# EAGLE design PI_Shield (EAGLE 9.1.3)

## Sheet 1 of 3
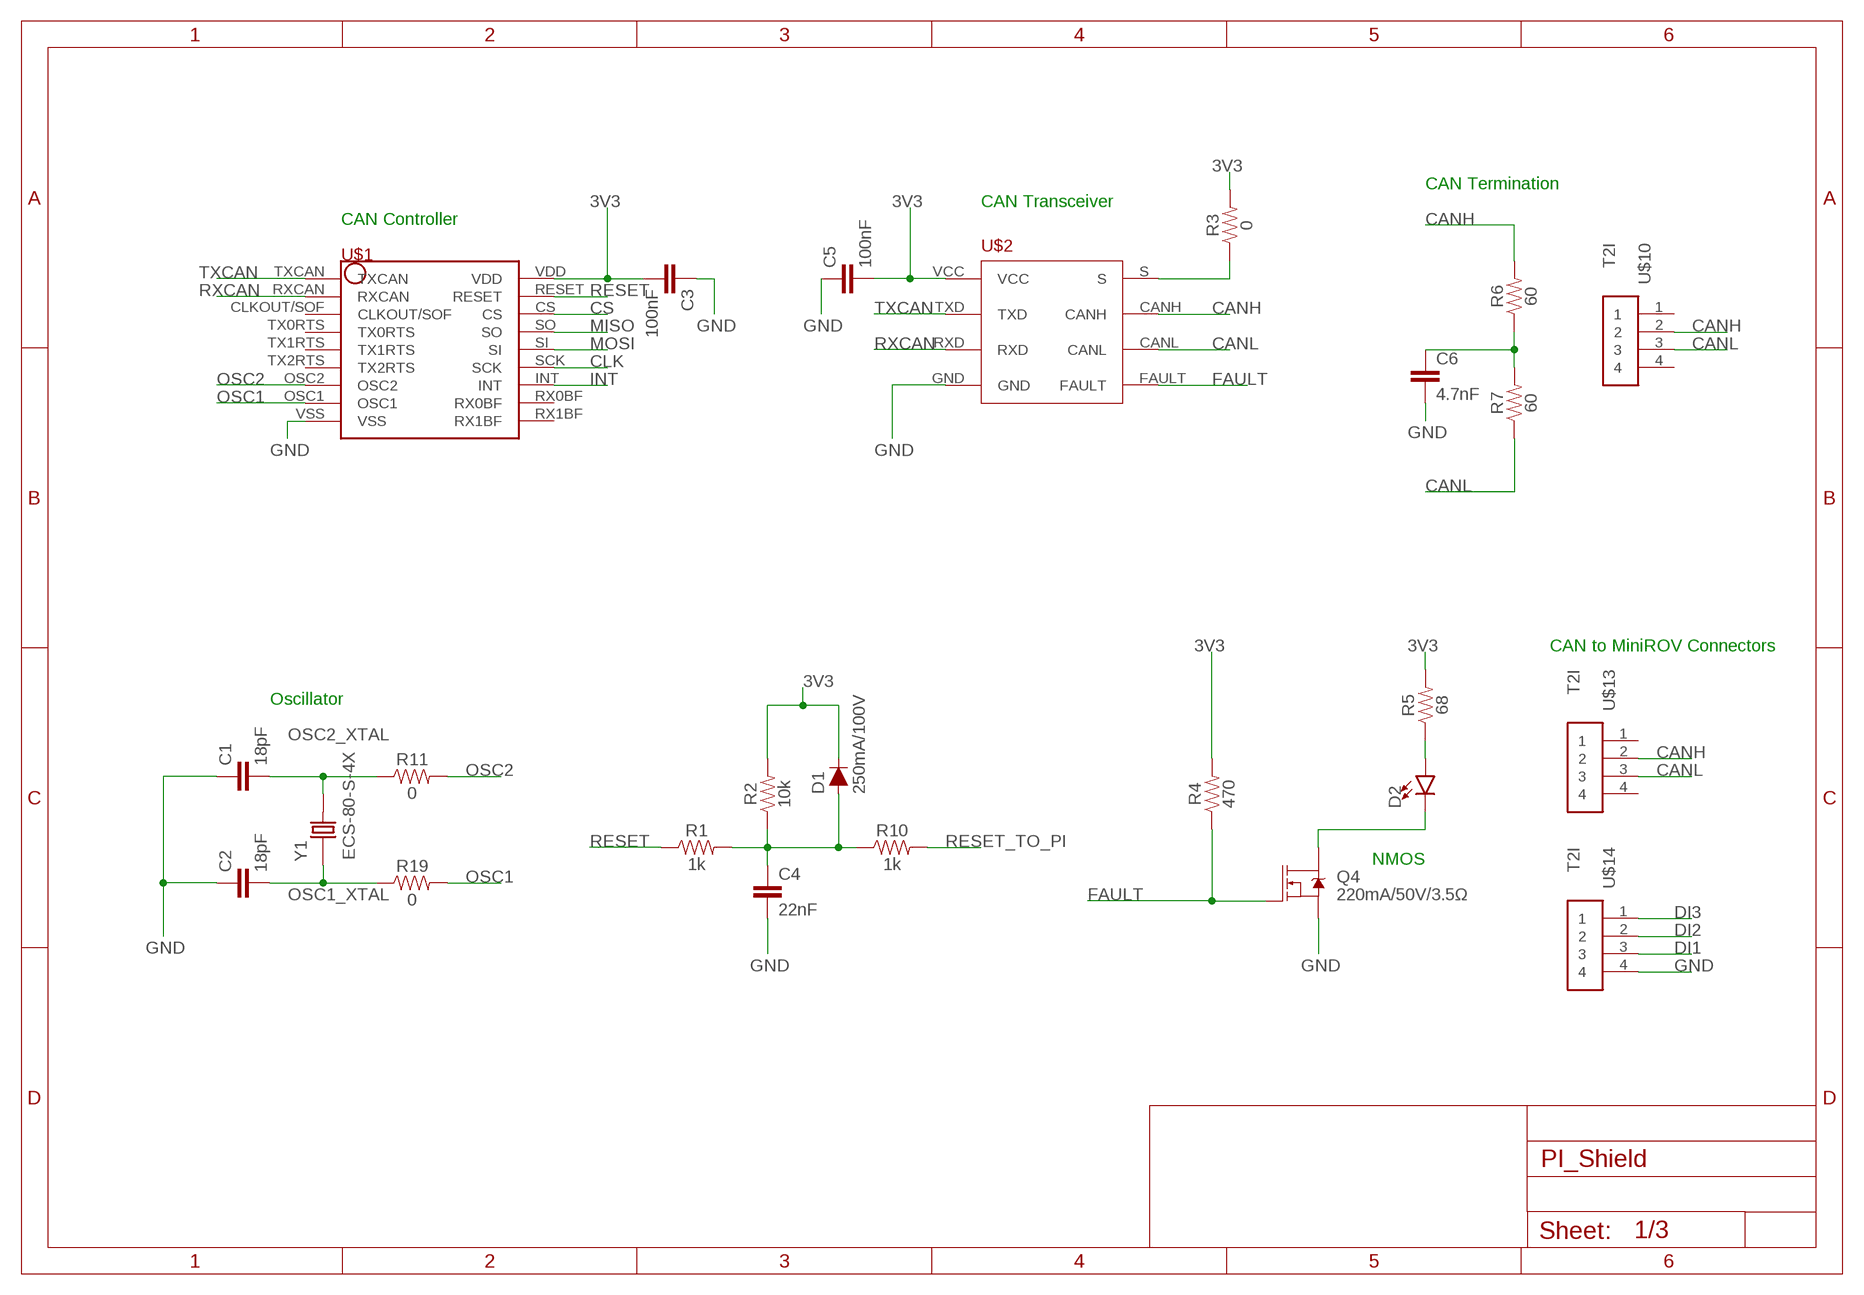
[diagram p0: schematic, sheet 1]

### Parts
C1  18pF  22PF-0603-50V-5%  [0603]
C2  18pF  22PF-0603-50V-5%  [0603]
C3  100nF  22NF/22,000PF-0603-50V-10%  [0603]
C4  22nF  22NF/22,000PF-0603-50V-10%  [0603]
C5  100nF  22NF/22,000PF-0603-50V-10%  [0603]
C6  4.7nF  22NF/22,000PF-0603-50V-10%  [0603]
D1  250mA/100V  DIODE-BAS16J  [SOD-323]
D2  LED0603  [LED-0603]
Q4  220mA/50V/3.5Ω  MOSFET-NCH-BSS138  [SOT23-3]
R1  1k  RESISTOR0603  [0603]
R2  10k  RESISTOR0603  [0603]
R3  0  RESISTOR0603  [0603]
R4  470  RESISTOR0603  [0603]
R5  68  RESISTOR0603  [0603]
R6  60  RESISTOR0603  [0603]
R7  60  RESISTOR0603  [0603]
R10  1k  RESISTOR0603  [0603]
R11  0  RESISTOR0603  [0603]
R19  0  RESISTOR0603  [0603]
U$1  MCP2515  [MCP2515]
U$2  TCAN337D  [TCAN337D]
U$10  T2I  [T2I]
U$13  T2I  [T2I]
U$14  T2I  [T2I]
Y1  ECS-80-S-4X  [XTAL_ECS-80-S-4X]

### Nets
3V3: C3.2 C5.2 D1.C R2.2 R3.2 R4.2 R5.2 U$1.VDD U$2.VCC ; also sheet 2,3
CANH: R6.2 U$2.CANH U$10.2 U$13.2 ; also sheet 2
CANL: R7.1 U$2.CANL U$10.3 U$13.3 ; also sheet 2
CLK: U$1.SCK ; also sheet 2
CS: U$1.CS ; also sheet 2
DI1: U$14.3 ; also sheet 2
DI2: U$14.2 ; also sheet 2
DI3: U$14.1 ; also sheet 2
FAULT: Q4.1(G) R4.1 U$2.FAULT
GND: C1.1 C2.1 C3.1 C4.2 C5.1 C6.2 Q4.2(S) U$1.VSS U$2.GND U$14.4 ; also sheet 2,3
INT: U$1.INT ; also sheet 2
MISO: U$1.SO ; also sheet 2
MOSI: U$1.SI ; also sheet 2
N$1: R3.1 U$2.S
N$2: C6.1 R6.1 R7.2
N$3: C4.1 D1.A R1.2 R2.1 R10.1
N$4: D2.C Q4.3(D)
N$5: D2.A R5.1
OSC1: R19.2 U$1.OSC1
OSC1_XTAL: C2.2 R19.1 Y1.1
OSC2: R11.2 U$1.OSC2
OSC2_XTAL: C1.2 R11.1 Y1.2
RESET: R1.1 U$1.RESET
RESET_TO_PI: R10.2 ; also sheet 2
RXCAN: U$1.RXCAN U$2.RXD
TXCAN: U$1.TXCAN U$2.TXD
Unconnected: U$1.CLKOUT/SOF U$1.RX0BF U$1.RX1BF U$1.TX0RTS U$1.TX1RTS U$1.TX2RTS U$10.1 U$10.4 U$13.1 U$13.4

### Notes on the sheet
- CAN Termination
- CAN Transceiver
- CAN Controller
- CAN to MiniROV Connectors
- Oscillator
- NMOS

## Sheet 2 of 3
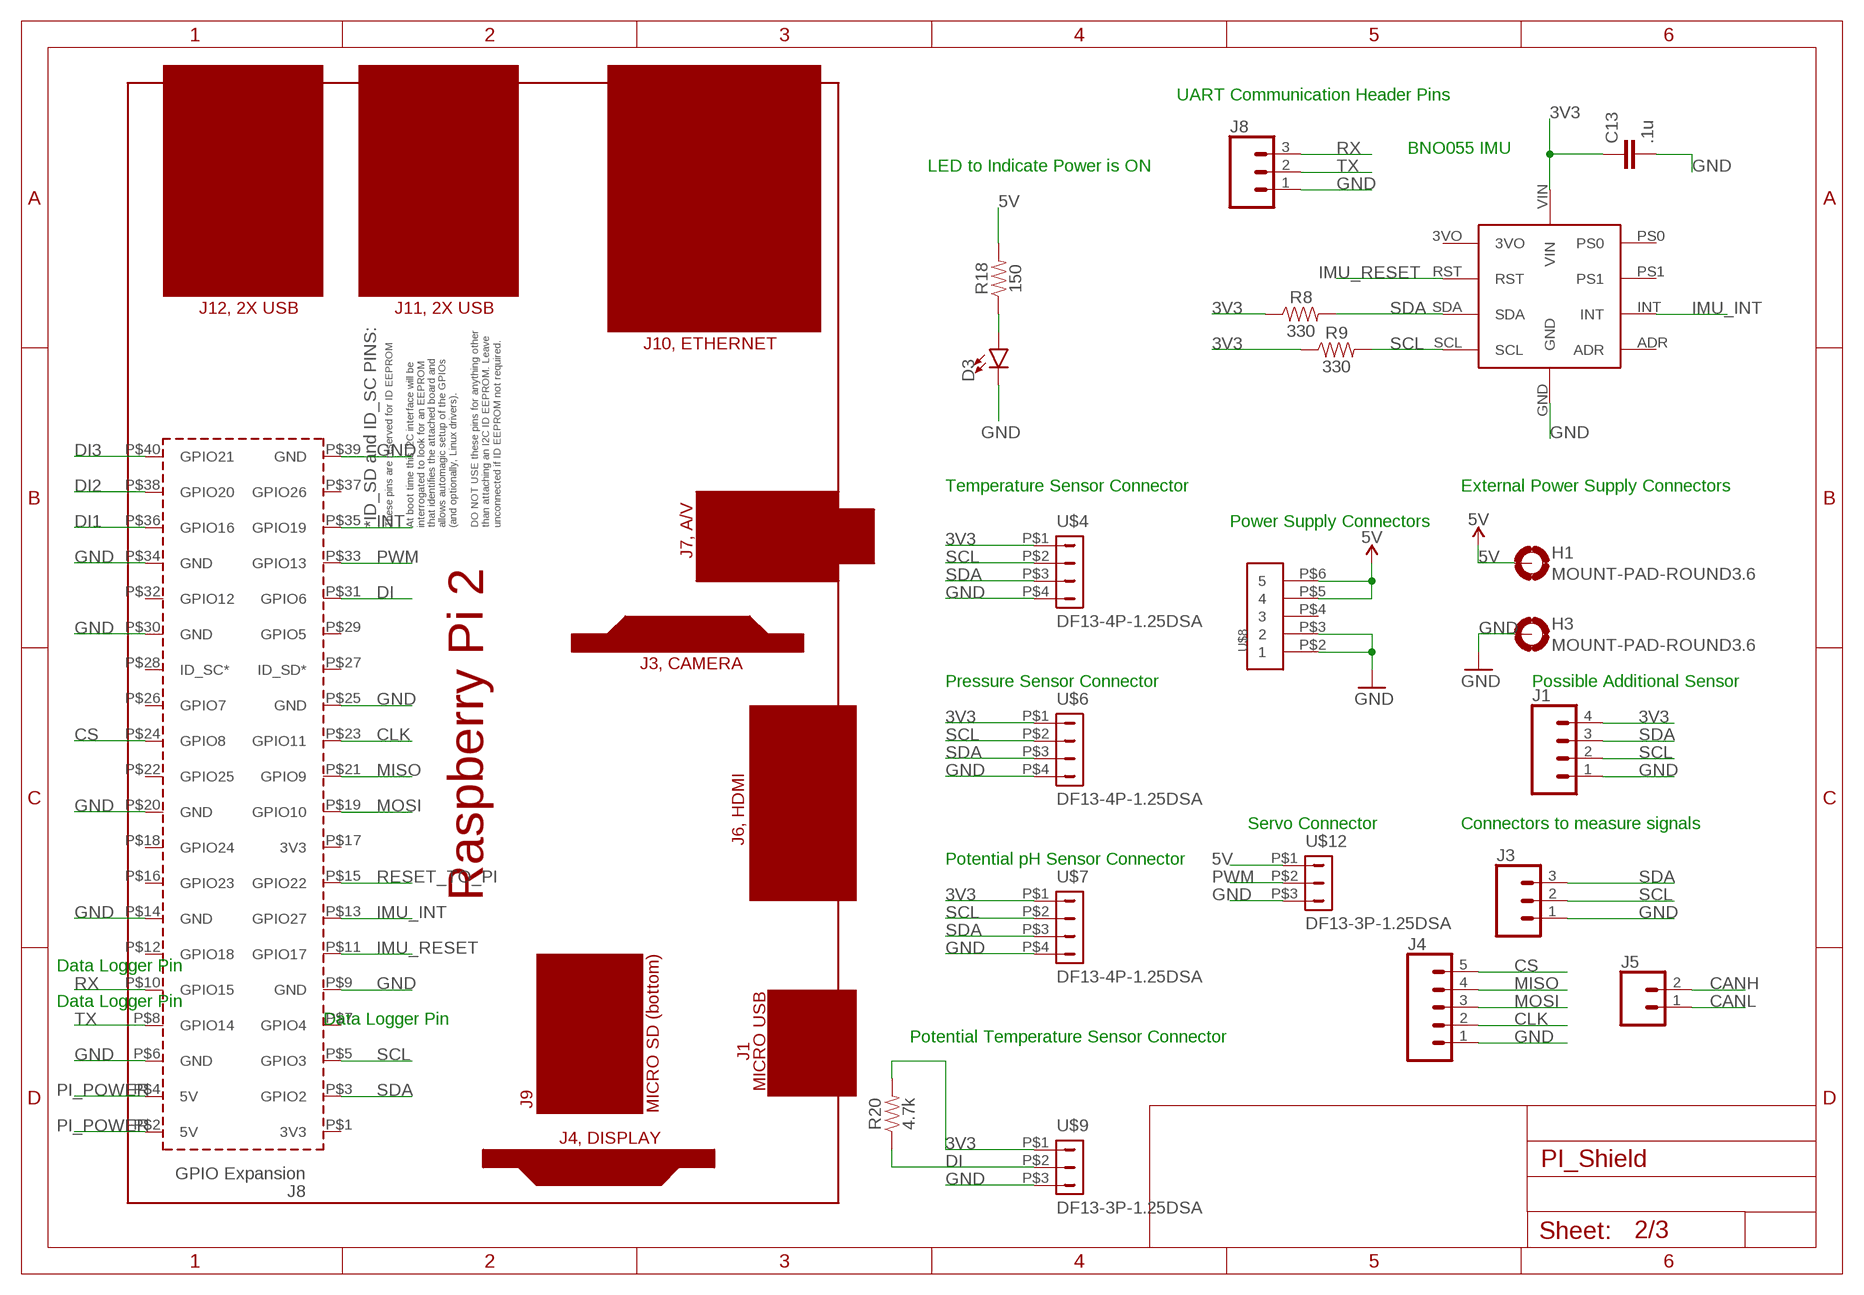
[diagram p1: schematic, sheet 2]

### Parts
C13  .1u  22NF/22,000PF-0603-50V-10%  [0603]
D3  LED0603  [LED-0603]
H1  MOUNT-PAD-ROUND3.6  [3,6-PAD]
H3  MOUNT-PAD-ROUND3.6  [3,6-PAD]
J1  CONN_04  [1X04]
J3  CONN_03  [1X03]
J4  CONN_05  [1X05]
J5  CONN_02  [1X02]
J8  CONN_03  [1X03]
PCB1  RPI2  [RPI2]
R8  330  RESISTOR0603  [0603]
R9  330  RESISTOR0603  [0603]
R18  150  RESISTOR0603  [0603]
R20  4.7k  RESISTOR0603  [0603]
U$3  BNO055_9DOF_BREAKOUT  [BNO055]
U$4  DF13-4P-1.25DSA  [DF13-4P-1.25DSA]
U$6  DF13-4P-1.25DSA  [DF13-4P-1.25DSA]
U$7  DF13-4P-1.25DSA  [DF13-4P-1.25DSA]
U$8  T2I5P  [T2I5P]
U$9  DF13-3P-1.25DSA  [DF13-3P-1.25DSA]
U$12  DF13-3P-1.25DSA  [DF13-3P-1.25DSA]

### Nets
3V3: C13.1 J1.4 R8.1 R9.1 R20.2 U$3.VIN U$4.P$1 U$6.P$1 U$7.P$1 U$9.P$1 ; also sheet 1,3
5V: H1.B3,6(MOUNT) R18.2 U$8.P$5 U$8.P$6 U$12.P$1 ; also sheet 3
CANH: J5.2 ; also sheet 1
CANL: J5.1 ; also sheet 1
CLK: J4.2 PCB1.P$23(GPIO11) ; also sheet 1
CS: J4.5 PCB1.P$24(GPIO8) ; also sheet 1
DI: PCB1.P$31(GPIO6) R20.1 U$9.P$2
DI1: PCB1.P$36(GPIO16) ; also sheet 1
DI2: PCB1.P$38(GPIO20) ; also sheet 1
DI3: PCB1.P$40(GPIO21) ; also sheet 1
GND: C13.2 D3.C H3.B3,6(MOUNT) J1.1 J3.1 J4.1 J8.1 PCB1.P$6(GND) PCB1.P$9(GND) PCB1.P$14(GND) PCB1.P$20(GND) PCB1.P$25(GND) PCB1.P$30(GND) PCB1.P$34(GND) PCB1.P$39(GND) U$3.GND U$4.P$4 U$6.P$4 U$7.P$4 U$8.P$2 U$8.P$3 U$9.P$3 U$12.P$3 ; also sheet 1,3
IMU_INT: PCB1.P$13(GPIO27) U$3.INT
IMU_RESET: PCB1.P$11(GPIO17) U$3.RST
INT: PCB1.P$35(GPIO19) ; also sheet 1
MISO: J4.4 PCB1.P$21(GPIO9) ; also sheet 1
MOSI: J4.3 PCB1.P$19(GPIO10) ; also sheet 1
N$9: D3.A R18.1
PI_POWER: PCB1.P$2(5V) PCB1.P$4(5V) ; also sheet 3
PWM: PCB1.P$33(GPIO13) U$12.P$2
RESET_TO_PI: PCB1.P$15(GPIO22) ; also sheet 1
RX: J8.3 PCB1.P$10(GPIO15)
SCL: J1.2 J3.2 PCB1.P$5(GPIO3) R9.2 U$3.SCL U$4.P$2 U$6.P$2 U$7.P$2 ; also sheet 3
SDA: J1.3 J3.3 PCB1.P$3(GPIO2) R8.2 U$3.SDA U$4.P$3 U$6.P$3 U$7.P$3 ; also sheet 3
TX: J8.2 PCB1.P$8(GPIO14)
Unconnected: PCB1.P$1(3V3) PCB1.P$7(GPIO4) PCB1.P$12(GPIO18) PCB1.P$16(GPIO23) PCB1.P$17(3V3) PCB1.P$18(GPIO24) PCB1.P$22(GPIO25) PCB1.P$26(GPIO7) PCB1.P$27(ID_SD*) PCB1.P$28(ID_SC*) PCB1.P$29(GPIO5) PCB1.P$32(GPIO12) PCB1.P$37(GPIO26) U$3.3VO U$3.ADR U$3.PS0 U$3.PS1 U$8.P$4

### Notes on the sheet
- UART Communication Header Pins
- BNO055 IMU
- LED to Indicate Power is ON
- Temperature Sensor Connector | External Power Supply Connectors
- Power Supply Connectors
- Pressure Sensor Connector | Possible Additional Sensor
- Servo Connector | Connectors to measure signals
- Potential pH Sensor Connector
- Data Logger Pin
- Data Logger Pin
- Data Logger Pin
- Potential Temperature Sensor Connector

## Sheet 3 of 3
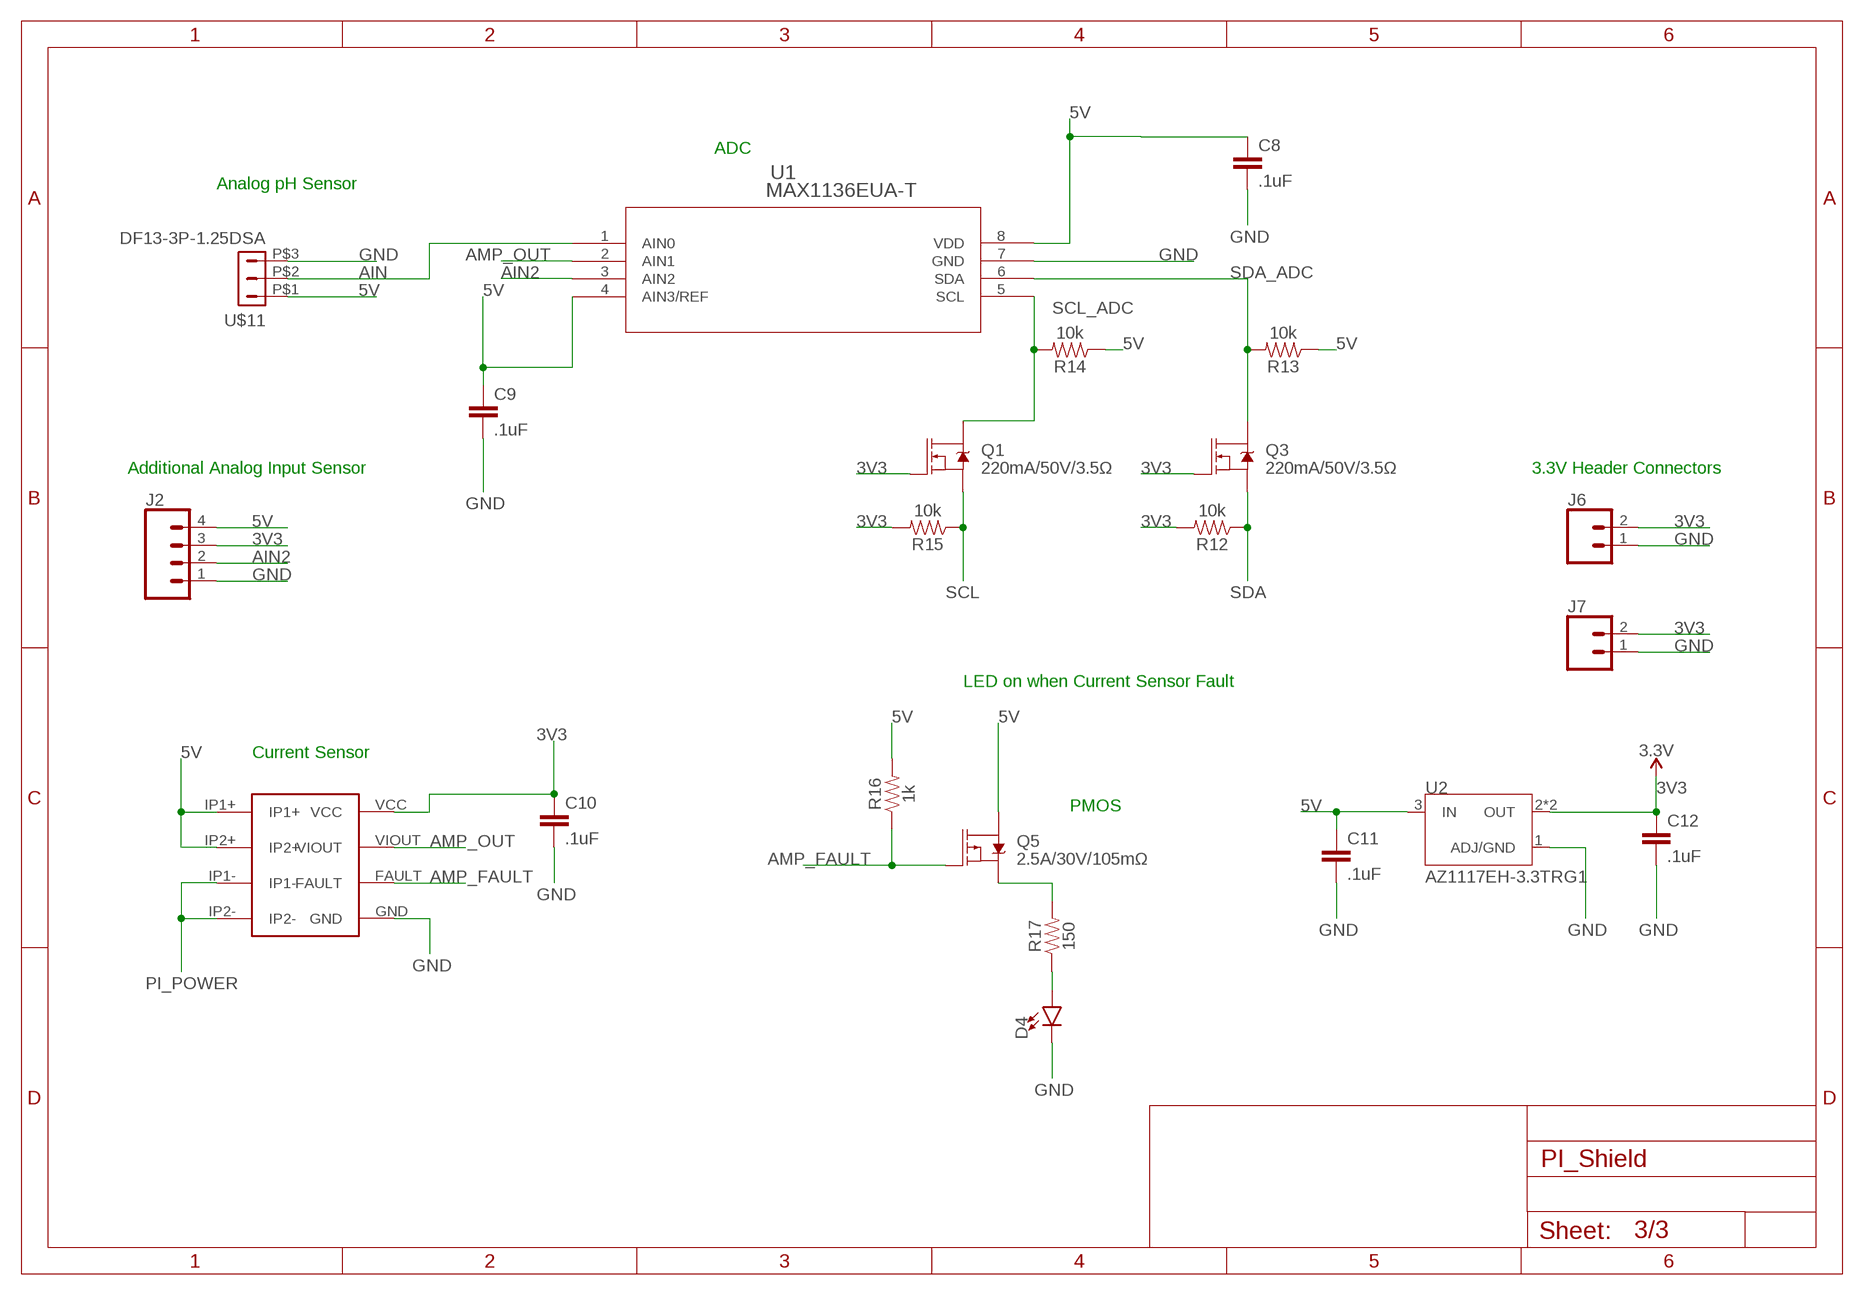
[diagram p2: schematic, sheet 3]

### Parts
C8  .1uF  22NF/22,000PF-0603-50V-10%  [0603]
C9  .1uF  22NF/22,000PF-0603-50V-10%  [0603]
C10  .1uF  22NF/22,000PF-0603-50V-10%  [0603]
C11  .1uF  22NF/22,000PF-0603-50V-10%  [0603]
C12  .1uF  22NF/22,000PF-0603-50V-10%  [0603]
D4  LED0603  [LED-0603]
J2  CONN_04  [1X04]
J6  CONN_02  [1X02]
J7  CONN_02  [1X02]
Q1  220mA/50V/3.5Ω  MOSFET-NCH-BSS138  [SOT23-3]
Q3  220mA/50V/3.5Ω  MOSFET-NCH-BSS138  [SOT23-3]
Q5  2.5A/30V/105mΩ  MOSFET_PCH-DMG2307L  [SOT23-3]
R12  10k  RESISTOR0603  [0603]
R13  10k  RESISTOR0603  [0603]
R14  10k  RESISTOR0603  [0603]
R15  10k  RESISTOR0603  [0603]
R16  1k  RESISTOR0603  [0603]
R17  150  RESISTOR0603  [0603]
U1  MAX1136EUA-T  [21-0036K]
U2  AZ1117EH-3.3TRG1  [SOT230P700X180-4N]
U$5  ACS711  [ACS711]
U$11  DF13-3P-1.25DSA  [DF13-3P-1.25DSA]

### Nets
3V3: C10.1 C12.1 J2.3 J6.2 J7.2 Q1.1(G) Q3.1(G) R12.2 R15.2 U2.2(OUT) U2.4(OUT) U$5.VCC ; supply symbol labelled 3.3V ; also sheet 1,2
5V: C8.1 C9.1 C11.1 J2.4 Q5.3(D) R13.1 R14.1 R16.2 U1.4(AIN3/REF) U1.8(VDD) U2.3(IN) U$5.IP1+ U$5.IP2+ U$11.P$1 ; also sheet 2
AIN: U1.1(AIN0) U$11.P$2
AIN2: J2.2 U1.3(AIN2)
AMP_FAULT: Q5.1(G) R16.1 U$5.FAULT
AMP_OUT: U1.2(AIN1) U$5.VIOUT
GND: C8.2 C9.2 C10.2 C11.2 C12.2 D4.C J2.1 J6.1 J7.1 U1.7(GND) U2.1(ADJ/GND) U$5.GND U$11.P$3 ; also sheet 1,2
N$10: Q5.2(S) R17.2
N$11: D4.A R17.1
PI_POWER: U$5.IP1- U$5.IP2- ; also sheet 2
SCL: Q1.2(S) R15.1 ; also sheet 2
SCL_ADC: Q1.3(D) R14.2 U1.5(SCL)
SDA: Q3.2(S) R12.1 ; also sheet 2
SDA_ADC: Q3.3(D) R13.2 U1.6(SDA)

### Notes on the sheet
- ADC
- Analog pH Sensor
- Additional Analog Input Sensor | 3.3V Header Connectors
- LED on when Current Sensor Fault
- Current Sensor
- PMOS

## Library data of the parts
C1 C2 = SparkFun-Capacitors:22PF: 22pF ceramic capacitors A capacitor is a passive two-terminal electrical component used to store electrical energy temporarily in an electric field.; PROD_ID: CAP-07876; VALUE: 22pF
C3 C5 C6 C8-C13 = SparkFun-Capacitors:22NF/22,000PF: 0.022uF/22nF/22,000pF ceramic capacitors A capacitor is a passive two-terminal electrical component used to store electrical energy temporarily in an electric field.; PROD_ID: CAP-07885; VALUE: 22nF
C4 = SparkFun-Capacitors:22NF/22,000PF: 0.022uF/22nF/22,000pF ceramic capacitors A capacitor is a passive two-terminal electrical component used to store electrical energy temporarily in an electric field.; PROD_ID: CAP-07885
D1 = SparkFun-DiscreteSemi:DIODE: Diode These are standard reverse protection diodes and small signal diodes. SparkFun Products: SparkFun SparkPunk Sound Kit <https://www.sparkfun.com/products/11177> SparkFun ESP8266 Thing <https://www.sparkfun.com/products/13231>; PROD_ID: DIO-09646
D2-D4 = SparkFun-LED:LED: LED (Generic) Standard schematic elements and footprints for 5mm, 3mm, 1206, and 0603 sized LEDs. Generic LEDs with no color specified.
H1 H3 = holes:MOUNT-PAD-ROUND: MOUNTING PAD, round
J1 J2 = SparkFun-Connectors:CONN_04: Multi connection point. Often used as Generic Header-pin footprint for 0.1 inch spaced/style header connections On any of the 0.1 inch spaced packages, you can populate with these: Break Away Headers - Straight <https://www.sparkfun.com/products/116> (PRT-00116) Break Away Male Headers - Right Angle <https://www.sparkfun.com/products/553> (PRT-00553) Female Headers <https://www.sparkfun.com/products/115> (PRT-00115) Break Away Headers - Machine Pin <https://www.sparkfun.com/products/117> (PRT-00117) Break Away Female Headers - Swiss Machine Pin <https://www.sparkfun.com/products/743> (PRT-00743) For SCREWTERMINALS and SPRING TERMINALS visit here: Screw Terimnals on SparkFun.com <https://www.sparkfun.com/search/results?term=Screw+Terminals> (5mm/3.5mm/2.54mm spacing) This device is also useful as a general connection point to wire up your design to another part of your project. Our various solder wires solder well into these plated through hole pads. Hook-Up Wire - Assortment (Stranded, 22 AWG) <https://www.sparkfun.com/products/11375> (PRT-11375) Hook-Up Wire - Assortment (Solid Core, 22 AWG) <https://www.sparkfun.com/products/11367> (PRT-11367) View the entire wire category on our website here <https://www.sparkfun.com/categories/141> Special notes: Molex polarized connector foot print use with SKU : PRT-08231 with associated crimp pins and housings. 1MM SMD Version SKU: PRT-10208; PROD_ID: CONN-09696
J3 J8 = SparkFun-Connectors:CONN_03: Multi connection point. Often used as Generic Header-pin footprint for 0.1 inch spaced/style header connections On any of the 0.1 inch spaced packages, you can populate with these: Break Away Headers - Straight <https://www.sparkfun.com/products/116> (PRT-00116) Break Away Male Headers - Right Angle <https://www.sparkfun.com/products/553> (PRT-00553) Female Headers <https://www.sparkfun.com/products/115> (PRT-00115) Break Away Headers - Machine Pin <https://www.sparkfun.com/products/117> (PRT-00117) Break Away Female Headers - Swiss Machine Pin <https://www.sparkfun.com/products/743> (PRT-00743) Stackable Header - 3 Pin (Female, 0.1") <https://www.sparkfun.com/products/13875> (PRT-13875) For SCREWTERMINALS and SPRING TERMINALS visit here: Screw Terimnals on SparkFun.com <https://www.sparkfun.com/search/results?term=Screw+Terminals> (5mm/3.5mm/2.54mm spacing) This device is also useful as a general connection point to wire up your design to another part of your project. Our various solder wires solder well into these plated through hole pads. Hook-Up Wire - Assortment (Stranded, 22 AWG) <https://www.sparkfun.com/products/11375> (PRT-11375) Hook-Up Wire - Assortment (Solid Core, 22 AWG) <https://www.sparkfun.com/products/11367> (PRT-11367) View the entire wire category on our website here <https://www.sparkfun.com/categories/141> Special notes: Molex polarized connector foot print use with SKU : PRT-08232 with associated crimp pins and housings.
J4 = SparkFun-Connectors:CONN_05: Multi connection point. Often used as Generic Header-pin footprint for 0.1 inch spaced/style header connections On any of the 0.1 inch spaced packages, you can populate with these: Break Away Headers - Straight <https://www.sparkfun.com/products/116> (PRT-00116) Break Away Male Headers - Right Angle <https://www.sparkfun.com/products/553> (PRT-00553) Female Headers <https://www.sparkfun.com/products/115> (PRT-00115) Break Away Headers - Machine Pin <https://www.sparkfun.com/products/117> (PRT-00117) Break Away Female Headers - Swiss Machine Pin <https://www.sparkfun.com/products/743> (PRT-00743) For SCREWTERMINALS and SPRING TERMINALS visit here: Screw Terimnals on SparkFun.com <https://www.sparkfun.com/search/results?term=Screw+Terminals> (5mm/3.5mm/2.54mm spacing) This device is also useful as a general connection point to wire up your design to another part of your project. Our various solder wires solder well into these plated through hole pads. Hook-Up Wire - Assortment (Stranded, 22 AWG) <https://www.sparkfun.com/products/11375> (PRT-11375) Hook-Up Wire - Assortment (Solid Core, 22 AWG) <https://www.sparkfun.com/products/11367> (PRT-11367) View the entire wire category on our website here <https://www.sparkfun.com/categories/141> Special notes: Molex polarized connector foot print use with SKU : PRT-08231 with associated crimp pins and housings. 1MM SMD Version SKU: PRT-10208
J5-J7 = SparkFun-Connectors:CONN_02: Multi connection point. Often used as Generic Header-pin footprint for 0.1 inch spaced/style header connections On any of the 0.1 inch spaced packages, you can populate with these: Break Away Headers - Straight <https://www.sparkfun.com/products/116> (PRT-00116) Break Away Male Headers - Right Angle <https://www.sparkfun.com/products/553> (PRT-00553) Female Headers <https://www.sparkfun.com/products/115> (PRT-00115) Break Away Headers - Machine Pin <https://www.sparkfun.com/products/117> (PRT-00117) Break Away Female Headers - Swiss Machine Pin <https://www.sparkfun.com/products/743> (PRT-00743) For SCREWTERMINALS and SPRING TERMINALS visit here: Screw Terimnals on SparkFun.com <https://www.sparkfun.com/search/results?term=Screw+Terminals> (5mm/3.5mm/2.54mm spacing) This device is also useful as a general connection point to wire up your design to another part of your project. Our various solder wires solder well into these plated through hole pads. Hook-Up Wire - Assortment (Stranded, 22 AWG) <https://www.sparkfun.com/products/11375> (PRT-11375) Hook-Up Wire - Assortment (Solid Core, 22 AWG) <https://www.sparkfun.com/products/11367> (PRT-11367) View the entire wire category on our website here <https://www.sparkfun.com/categories/141> Special notes: Molex polarized connector foot print use with: PRT-08233 with associated crimp pins and housings. 2.54_SCREWTERM for use with PRT-10571. 3.5mm Screw Terminal footprints for PRT-08084 5mm Screw Terminal footprints for use with PRT-08432
PCB1 = MicrocontrollerComponents:RPI2: Device for Raspberry Pi 2 board created by www.element14.com More information and support community is available at http://www.element14.com/community/community/raspberry-pi/raspberrypi2
Q1 Q3 Q4 = SparkFun-DiscreteSemi:MOSFET-NCH: N-channel MOSFETs Voltage controlled devices that allow control of high current outputs. SparkFun Products: SparkFun OpenScale <https://www.sparkfun.com/products/13261> SparkFun Digital Sandbox <https://www.sparkfun.com/products/12651> SparkFun Monster Moto Shield <https://www.sparkfun.com/products/10182> SparkFun MOSFET Power Controller <https://www.sparkfun.com/products/11214>; PROD_ID: TRANS-00830
Q5 = SparkFun-DiscreteSemi:MOSFET_PCH: P-channel MOSFETs Voltage controlled devices that allow control of high current outputs. SparkFun Products: SparkFun ESP32 Thing <https://www.sparkfun.com/products/13907> SparkFun ESP8266 Thing <https://www.sparkfun.com/products/13231>; PROD_ID: TRANS-11308
R1-R20 = SparkFun-Resistors:RESISTOR: Generic Resistor Package
U1 = MAX1136EUA-T:MAX1136EUA-T; DESCRIPTION: 2.7V to 3.6V and 4.5V to 5.5V, Low-Power, 4-/12-Channel, 2-Wire Serial 10-Bit AD; DIGI-KEY_PART_NUMBER: MAX1136EUA+-ND; DIGI-KEY_PURCHASE_URL: https://www.digikey.com/product-detail/en/maxim-integrated/MAX1136EUA-/MAX1136EUA--ND/1159953?utm_source=snapeda&utm_medium=aggregator&utm_campaign=symbol; MF: Maxim Integrated; MP: MAX1136EUA+; PACKAGE: MSOP-8 Maxim Integrated
U2 = AZ1117EH-3.3TRG1:AZ1117EH-3.3TRG1: Ldo.Vreg Pos 3, 3v 1a Sot223; AVAILABILITY: Unavailable; DESCRIPTION: Ldo.Vreg Pos 3, 3v 1a Sot223; MF: Diodes Inc.; MP: AZ1117EH-3.3TRG1; PACKAGE: SOT-223 Diodes Inc.; PRICE: None
U$1 = PI_Shield_Library:MCP2515
U$2 = PI_Shield_Library:TCAN337D
U$3 = Other:BNO055_9DOF_BREAKOUT
U$4 U$6 U$7 = con-hirose-df13:DF13-4P-1.25: DF13-4P 1.25mm Pitch Miniature Crimping Connector.
U$5 = ACS711_ameter:ACS711
U$8 = BackplaneParts:T2I5P
U$9 U$11 U$12 = con-hirose-df13:DF13-3P-1.25: DF13-3P 1.25mm Pitch Miniature Crimping Connector.
U$10 U$13 U$14 = BackplaneParts:T2I
Y1 = ECS-80-S-4X:ECS-80-S-4X: CRYSTAL T/H; DESCRIPTION: Crystal 8MHz Series 2-Pin HC-49/U; DIGI-KEY_PART_NUMBER: X1057-ND; DIGI-KEY_PURCHASE_URL: https://www.digikey.com/product-detail/en/ecs-inc/ECS-80-S-4X/X1057-ND/827549?utm_source=snapeda&utm_medium=aggregator&utm_campaign=symbol; MF: ECS International; MP: ECS-80-S-4X; PACKAGE: HC-49/US ECS International

## Board
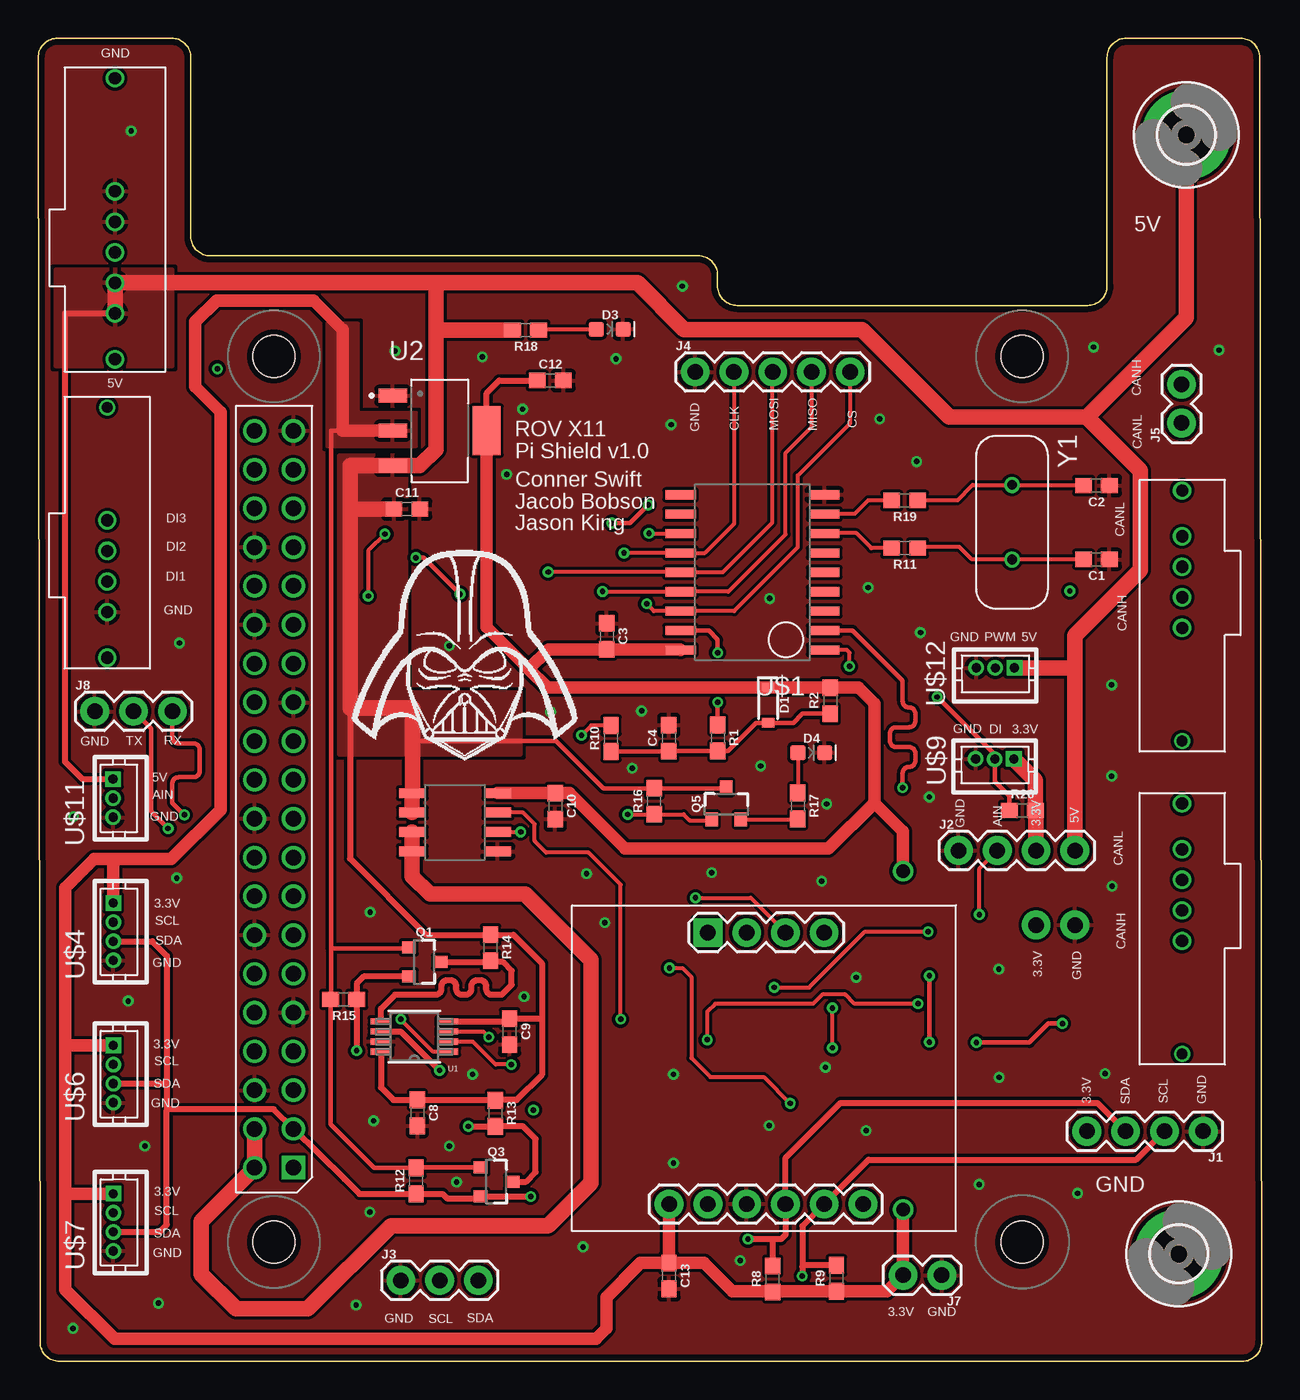
[diagram p3: board, top side]
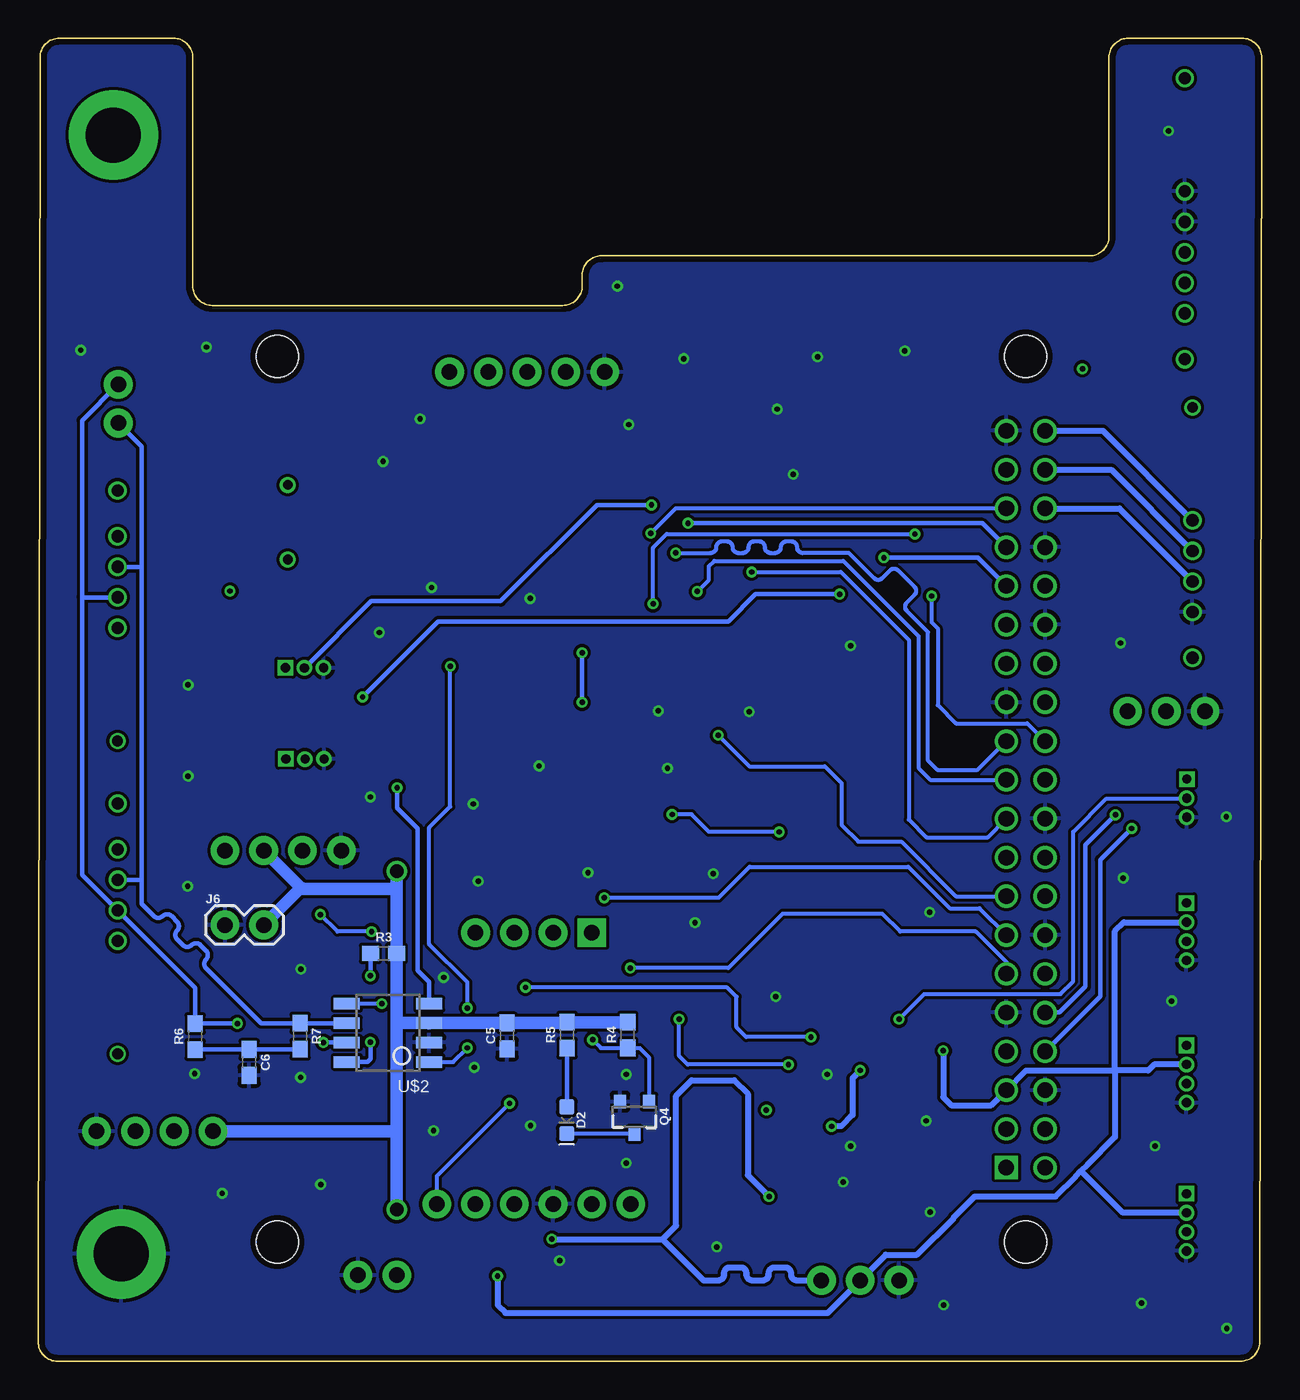
[diagram p4: board, bottom side, seen from below]

Size 80.12 x 86.65 mm. Coordinates in mm from the lower left corner, seen from the top.
Outline: 80,85.38 80.12,1.27 arc-90 78.85,0 1.39,0 arc-90 0.12,1.27 0,85.38 arc-90 1.27,86.65 8.73,86.65 arc-90 10,85.38 10,73.67 arc90 11.27,72.4 43.23,72.4 arc-90 44.5,71.13 44.5,70.42 arc90 45.77,69.15 68.73,69.15 arc90 70,70.42 70,85.38 arc-90 71.27,86.65 78.73,86.65 arc-90 80,85.38
Copper layers (1*16): Top 0.0356mm / dielectric 1.5011mm / Bottom 0.0356mm
Design rules "customDRC": minimum track width 8mil, minimum drill 13mil, track to track 8mil, track to pad 8mil, pad to pad 6mil, via to via 8mil, smd to smd 6mil, copper to edge 15mil, drill to drill 8mil, minimum pad ring 7mil, minimum via ring 7mil, stop-mask expansion 3mil, vias tented up to drill 0mil, thermal gap 10mil

### Footprints (pad centres in the part's own frame; a part is rotated, then mirrored left to right if it is on the bottom)
0603 = smd 1.1 x 1: 1 -0.85,0; 2 0.85,0
SOD-323 = smd 0.63 x 0.83: A 1.15,0; C -1.15,0
LED-0603 = smd 1 x 1: A -0.877,0; C 0.877,0
3,6-PAD = drill 3.6 pad 5.842: B3,6 0,0
1X04 = drill 1.016 pad 1.88: 1 0,0; 2 2.54,0; 3 5.08,0; 4 7.62,0
1X03 = drill 1.016 pad 1.88: 1 0,0; 2 2.54,0; 3 5.08,0
1X05 = drill 1.016 pad 1.88: 1 0,0; 2 2.54,0; 3 5.08,0; 4 7.62,0; 5 10.16,0
1X02 = drill 1.016 pad 1.88: 1 0,0; 2 2.54,0
RPI2 = drill 1.016 square: P$1 8.37,51.23 | drill 1.016: P$2 8.357,53.772; P$3 10.897,51.232; P$4 10.897,53.772; P$5 13.437,51.232; P$6 13.437,53.772; P$7 15.977,51.232; P$8 15.977,53.772; P$9 18.517,51.232; P$10 18.517,53.772; P$11 21.057,51.232; P$12 21.057,53.772; P$13 23.597,51.232; P$14 23.597,53.772; P$15 26.137,51.232; P$16 26.137,53.772; P$17 28.677,51.232; P$18 28.677,53.772; P$19 31.217,51.232; P$20 31.217,53.772; P$21 33.757,51.232; P$22 33.757,53.772; P$23 36.297,51.232; P$24 36.297,53.772; P$25 38.837,51.232; P$26 38.837,53.772; P$27 41.377,51.232; P$28 41.377,53.772; P$29 43.917,51.232; P$30 43.917,53.772; P$31 46.457,51.232; P$32 46.457,53.772; P$33 48.997,51.232; P$34 48.997,53.772; P$35 51.537,51.232; P$36 51.537,53.772; P$37 54.077,51.232; P$38 54.077,53.772; P$39 56.617,51.232; P$40 56.617,53.772 | hole 2.75: 3.5,3.5; 61.5,3.5; 3.5,52.5; 61.5,52.5
SOT23-3 = smd 0.8 x 0.9: 1 -0.95,-1; 2 0.95,-1; 3 0,1.1
21-0036K = smd 1.372 x 0.406: 1 -2.184,0.991; 2 -2.184,0.33; 3 -2.184,-0.33; 4 -2.184,-0.991; 5 2.184,-0.991; 6 2.184,-0.33; 7 2.184,0.33; 8 2.184,0.991
SOT230P700X180-4N = smd 1.86 x 0.9: 1 -3.075,2.3; 2 -3.075,0; 3 -3.075,-2.3 | smd 1.86 x 3.19: 4 3.075,0
MCP2515 = smd 2 x 0.6: CLKOUT/SOF 0,7.62; CS 9.4,7.62; INT 9.4,2.54; OSC1 0,1.27; OSC2 0,2.54; RESET 9.4,8.89; RX0BF 9.4,1.27; RX1BF 9.4,0; RXCAN 0,8.89; SCK 9.4,3.81; SI 9.4,5.08; SO 9.4,6.35; TX0RTS 0,6.35; TX1RTS 0,5.08; TX2RTS 0,3.81; TXCAN 0,10.16; VDD 9.4,10.16; VSS 0,0
TCAN337D = smd 1.7 x 0.75: CANH 5.4,2.54; CANL 5.4,1.27; FAULT 5.4,0; GND 0,2.54; RXD 0,0; S 5.4,3.81; TXD 0,3.81; VCC 0,1.27
BNO055 = drill 1.016 pad 1.88: 3VO -8.89,2.54; ADR 8.89,-5.08; GND -8.89,0; INT 8.89,-2.54; PS1 8.89,0; RST -8.89,-7.62; SCL -8.89,-5.08; SDA -8.89,-2.54; VIN -8.89,5.08 | drill 1.016 pad 1.88 square: PS0 8.89,2.54
DF13-4P-1.25DSA = drill 0.6 pad 1.016 square: P$1 1.875,0 | drill 0.6 pad 1.016: P$2 0.625,0; P$3 -0.625,0; P$4 -1.875,0
ACS711 = smd 1.75 x 0.65: FAULT 2.8,-0.635; GND 2.8,-1.905; IP1+ -2.8,1.905; IP1- -2.8,-0.635; IP2+ -2.8,0.635; IP2- -2.8,-1.905; VCC 2.8,1.905; VIOUT 2.8,0.635
T2I5P = drill 0.8: P$1 -19.1,3.3; P$2 -11.7,3.3; P$3 -9.7,3.3; P$4 -7.7,3.3; P$5 -5.7,3.3; P$6 -3.7,3.3; P$7 -0.7,3.3
DF13-3P-1.25DSA = drill 0.6 pad 1.016 square: P$1 1.25,0.005 | drill 0.6 pad 1.016: P$2 0,-0.005; P$3 -1.25,0
T2I = drill 0.8: 1 8.1,2.8; 2 10.1,2.8; 3 12.1,2.8; 4 14.1,2.8; S2 17.1,2.8 | drill 0.7: S1 0.7,2.8
XTAL_ECS-80-S-4X = drill 0.63 pad 1.03: 1 -2.44,0; 2 2.44,0

### Placement (x,y rotation side)
C1  69.31,52.52 180 top
C2  69.31,57.35 180 top
C3  37.24,47.48 270 top
C4  41.3,40.81 90 top
C5  49.42,21.32 90 bottom
C6  66.31,19.57 270 bottom
C8  24.83,16.27 270 top
C9  30.88,21.59 270 top
C10  33.86,36.36 270 top
C11  24.14,55.82 0 top
C12  33.54,64.23 0 top
C13  41.31,5.59 270 top
D1  47.81,42.97 270 top
D2  45.51,15.79 270 bottom
D3  37.44,67.59 0 top
D4  50.63,39.86 0 top
H1  75.19,80.31 0 top
H3  74.69,7.03 0 top
J1  76.3,15.06 180 top
J2  60.27,33.45 0 top
J3  23.75,5.3 0 top
J4  43.02,64.8 0 top
J5  74.88,61.44 90 top
J6  67.89,28.57 0 bottom
J7  59.18,5.64 180 top
J8  3.71,42.57 0 top
PCB1  67.95,4.32 90 top
Q1  25.27,26.15 270 top
Q3  29.98,11.76 270 top
Q4  41.07,16 180 bottom
Q5  45.06,36.49 0 top
R1  44.5,40.83 270 top
R2  51.88,43.26 90 top
R3  57.51,26.71 0 bottom
R4  41.51,21.37 90 bottom
R5  45.49,21.36 90 bottom
R6  69.84,21.27 90 bottom
R7  62.96,21.29 270 bottom
R8  48.11,5.38 90 top
R9  52.29,5.43 90 top
R10  37.51,40.79 90 top
R11  56.75,53.25 180 top
R12  24.76,11.82 90 top
R13  29.94,16.23 270 top
R14  29.62,27.09 270 top
R15  20.01,23.7 180 top
R16  40.35,36.68 90 top
R17  49.75,36.37 270 top
R18  31.93,67.53 180 top
R19  56.74,56.38 180 top
R20  64.45,36.08 0 top
U1  24.64,21.27 180 top
U2  26.29,60.95 0 top
U$1  51.48,56.75 180 top
U$2  54.51,23.41 180 bottom
U$3  46.4,19.19 90 top
U$4  4.92,28.13 90 top
U$5  27.3,35.3 0 top
U$6  4.92,18.82 90 top
U$7  4.92,9.1 90 top
U$8  1.74,64.92 270 top
U$9  62.65,39.45 0 top
U$10  77.72,19.43 90 top
U$11  4.9,36.88 90 top
U$12  62.69,45.42 0 top
U$13  77.72,39.93 90 top
U$14  1.73,63.17 270 top
Y1  63.78,54.95 270 top

### Tracks (layer width: path | path; a pad name or v marks a point on that pad's centre or on a via)
3V3  (via drill 0.9)
  Top 0.305: Q1.1 24.22,27.05 19.18,27.05 | 19.94,60.95 19.18,60.95 19.18,27.05 | 19.18,27.05 19.18,23.71 R15.2 19.16,15.51 22,12.67 R12.2 arc-90 24.8,12.71 Q3.1
  Top 0.406: U2.4 29.37,63.4 30.2,64.23 C12.1
  Top 0.813: 48.15,4.58 R9.1 55.58,4.58 J7.2 v56.64,9.93 | 48.15,4.58 R8.1 | 1.78,20.7 1.78,11.05 | 1.78,11.05 1.78,4.7 5,1.47 36.52,1.47 37.21,2.16 37.21,4.19 39.46,6.44 C13.1 | U2.4 29.37,48.1 32.13,45.34 | U$3.VIN C13.1 | C13.1 43.6,6.44 45.46,4.58 48.15,4.58 | U$7.P$1 1.85,10.98 1.78,11.05 | 4.95,32.89 8.71,32.89 11.94,36.12 11.94,42.47 11.94,62.18 10.29,63.83 10.29,68.07 11.68,69.47 18.03,69.47 19.94,67.56 19.94,60.95 U2.2 | 4.95,32.89 3.68,32.89 1.78,30.99 1.78,20.7 | 4.95,32.89 4.92,32.86 U$4.P$1 | U$6.P$1 1.79,20.69 1.78,20.7 | 32.13,45.34 33.35,44.12 D1.C R2.2 | R2.2 | 32.13,45.34 33.42,46.63 C3.2 42.04,46.63 U$1.VDD | R2.2 53.72,44.12 54.76,43.08 54.76,36.58 | 54.76,36.58 51.76,33.58 38.43,33.58 34.8,37.21 C10.1 U$5.VCC | 54.76,36.58 56.64,34.7 v56.64,32.11
  Top 1.016: J2.3 65.35,36.03 R20.2 65.3,38.05 U$9.P$1
  Bottom 0.813: v56.64,32.11 56.64,30.94 | 56.64,30.94 56.64,26.73 R3.2 56.66,22.17 | 56.66,22.17 56.66,15.09 | 56.66,15.09 56.66,9.95 v56.64,9.93 | 56.66,22.17 54.54,22.17 U$2.VCC 54.48,22.17 C5.2 45.53,22.17 R5.2 R4.2 | J1.4 56.68,15.06 56.66,15.09 | 62.94,30.94 56.64,30.94 | J2.3 62.94,31.04 62.94,30.94 | J6.2 62.99,30.94 62.94,30.94
  pour Top: 24.76,59.94 24.76,62.1 20.95,62.1 20.95,67.94 18.92,67.94 18.92,59.94
5V
  Top 0.305: Q5.3 45.01,37.53 R16.2 37.02,37.53 33.91,40.64 24.51,40.64 24.51,40.62
  Top 0.406: U1.8 22.46,17.93 23.27,17.12 C8.1 29.9,17.12 31.34,17.12 32.98,18.76 32.98,22.45 | U1.4 30.69,22.26 C9.1 32.98,22.45 | 32.98,22.45 32.99,22.45 32.99,26.06 31.12,27.94 R14.1 25.4,27.94 20.42,32.92 20.42,42.77 | U$8.P$6 1.75,68.62 1.75,39.27 2.89,38.13 U$11.P$1
  Top 0.762: 67.9,39.46 67.89,39.46
  Top 1.016: 68.68,61.85 59.69,61.85 53.96,67.58 42.3,67.58 39.25,70.62 26.08,70.62 26.07,70.61 | 68.68,61.85 75.19,68.36 H1.B3,6 | 26.07,67.53 R18.2 | 26.07,67.53 26.07,59.72 24.99,58.65 U2.3 20.42,58.65 20.42,55.8 | U$5.IP2+ U$5.IP1+ 24.51,37.22 24.51,40.62 | 29.9,17.12 R13.1 | 68.68,61.85 72.19,58.34 72.19,51.82 67.89,47.52 67.89,45.42 | U$12.P$1 67.89,45.42 | U$8.P$6 U$8.P$5 26.05,70.62 26.07,70.61 | 67.89,45.42 67.89,42 67.89,39.46 | J2.4 67.9,33.46 67.9,39.45 67.9,39.46 | 20.42,55.8 20.42,42.77 24.51,42.77 24.51,40.64 | C11.1 23.29,55.8 20.42,55.8 | 26.07,67.53 26.07,70.61
  pour Top: 19.68,39.75 31.62,39.75 31.62,43.82 24.13,43.82 24.13,59.31 19.68,59.31
  pour Top: 8.76,65.18 1.14,65.18 1.14,71.5 8.76,71.5
AIN  (via drill 0.35)
  Top 0.254: U1.1 25.87,20.28 v23.75,22.4
  Bottom 0.254: v23.75,22.4 22.1,24.05 13.18,24.05 12.34,24.89 12.34,34.67 10.16,36.86 4.93,36.86 U$11.P$2
AIN2  (via drill 0.35)
  Top 0.254: U1.3 29.15,21.6 v29.51,21.23 | v61.64,29.26 61.64,32.28 J2.2 | v58.29,28.14 54.15,28.14 50.49,24.49 v48.21,24.49
  Bottom 0.254: v29.51,21.23 33.76,21.23 34.39,21.87 34.39,23.88 35,24.49 v48.21,24.49 | v58.29,28.14 60.53,28.14 v61.64,29.26
AMP_FAULT  (via drill 0.35)
  Top 0.254: U$5.FAULT v31.59,34.67 v31.6,34.67 | v38.61,35.81 40.33,35.81 R16.1 42.27,35.83 42.67,35.43 44.06,35.43 Q5.1
  Bottom 0.254: v31.6,34.67 36.19,34.67 37.34,35.81 v38.61,35.81
AMP_OUT  (via drill 0.35)
  Top 0.254: v30.99,19.43 29.97,19.43 28.47,20.93 U1.2 | U$5.VIOUT 31.75,35.94 32.51,35.18 32.51,34.09 33.27,33.33 36.04,33.33 38.15,31.22 v38.15,22.4
  Bottom 0.254: v30.99,19.43 37.59,19.43 38.15,19.99 v38.15,22.4
CANH  (via drill 0.35)
  Top 0.305: v67.08,22.12 66.17,22.12 64.92,20.88 v61.44,20.88
  Bottom 0.305: v67.08,22.12 R6.2 69.84,24.45 U$10.2 77.24,31.85 77.24,50.06 | v61.44,20.88 U$2.CANH | J5.2 77.24,61.62 77.24,50.06 | U$13.2 77.21,50.03 77.24,50.06
CANL
  Bottom 0.305: U$2.CANL R7.1 65.53,22.14 69.13,25.74 arc90 69.13,26.31 arc-90 69.13,26.89 69.5,27.26 arc-90 70.08,27.26 arc90 70.65,27.26 71.02,27.64 arc90 71.02,28.21 arc-90 71.02,28.79 71.4,29.16 arc-90 71.97,29.16 arc90 72.55,29.16 73.35,29.97 73.35,31.55 | J5.1 73.35,59.92 73.35,51.99 | 73.35,31.55 73.35,51.99 | U$10.3 73.37,31.53 73.35,31.55 | U$13.3 73.39,52.03 73.35,51.99
CLK  (via drill 0.35)
  Top 0.254: v38.37,52.94 U$1.SCK 43.67,52.94 45.56,54.84 J4.2
  Bottom 0.254: v38.37,52.94 36.09,52.94 arc-90 35.71,53.32 arc90 35.33,53.7 35.03,53.7 arc90 34.65,53.32 arc-90 34.27,52.94 33.98,52.94 arc-90 33.6,53.32 arc90 33.22,53.7 32.92,53.7 arc90 32.54,53.32 arc-90 32.16,52.94 31.86,52.94 arc-90 31.48,53.32 arc90 31.1,53.7 30.81,53.7 arc90 30.43,53.32 arc-90 30.05,52.94 27.03,52.94 25.38,51.29 arc-90 24.84,51.29 24.34,51.8 arc90 23.8,51.8 22.74,50.73 arc90 22.74,50.19 23.24,49.69 arc-90 23.24,49.15 21.84,47.75 21.84,39.35 21.23,38.74 18.6,38.74 PCB1.P$23
CS  (via drill 0.35)
  Top 0.254: J4.5 53.18,61.44 49.76,58.01 49.76,53.32 45.57,49.13 U$1.CS 40.33,49.13 v39.85,49.61 | v22.71,54.18 21.61,53.09 v21.61,50.11
  Bottom 0.254: PCB1.P$24 15.34,41.78 20.01,41.78 21.21,42.98 21.21,48.01 21.61,48.41 v21.61,50.11 | v39.85,49.61 39.85,53.29 38.96,54.18 v22.71,54.18
DI  (via drill 0.35)
  Top 0.254: 62.65,39.74 U$9.P$2
  Top 0.305: v58.88,43.51 60.4,41.99 62.65,39.74 | R20.1 63.6,37.03 62.65,37.99 U$9.P$2 | v27.63,50.24 25.25,52.63 v24.74,52.63 | U$9.P$2
  Bottom 0.305: v58.88,43.51 53.92,48.46 34.92,48.46 33.15,50.24 v27.63,50.24 | v24.74,52.63 18.57,52.63 PCB1.P$31
DI1
  Bottom 0.406: PCB1.P$36 9.31,55.86 U$14.3
DI2
  Bottom 0.406: PCB1.P$38 9.85,58.4 U$14.2
DI3
  Bottom 0.406: PCB1.P$40 10.39,60.94 U$14.1
FAULT  (via drill 0.35)
  Top 0.254: v43.81,21.06 43.81,22.89 44.35,23.42 50.75,23.42 51.36,24.03 52.86,24.03 53.47,23.42 v57.62,23.42
  Bottom 0.254: v43.81,21.06 43.28,20.52 R4.1 40.74,20.52 40.13,19.91 40.13,17.01 Q4.1 | v57.62,23.42 59.89,23.42 arc-45 U$2.FAULT
GND  (via drill 0.35)
  other vias: 7.87,3.81 26.92,14.1 21.97,15.75 28.45,18.8 54.35,50.67 57.53,58.93 55.12,61.72 37.84,65.66 29.08,65.79 23.37,66.17 6.98,14.1 26.92,46.86 21.72,9.78 20.83,3.68 35.69,7.49 45.97,6.6 2.28,2.16 6.09,80.57 21.74,29.41 31.82,23.88 27.4,11.73 51.31,31.45 44.12,32 37.11,28.73 41.6,12.98 47.88,15.44 51.56,19.25 57.78,47.73 70.31,44.3 70.31,38.33 70.33,31.11 62.91,25.68 54.23,15.11 68.07,11 33.55,42.55 39.52,42.6 38.91,38.84 47.32,38.99 51.64,36.5 41.45,61.34 69.11,66.42 77.34,66.22 41.6,18.8 62.94,18.59 42.19,70.41 47.9,49.96 35.91,31.93 58.37,36.96 53.57,25.15 5.89,23.6 9.07,31.65 2.31,35.66 61.62,11.58 9.24,47.04 69.87,18.85 31.72,62.36 30.68,58.09
  pour Top (rank 4): -4.2,89.05 -4.2,-2.23 83.8,-2.23 83.8,89.05
  pour Bottom (rank 4): -4,89.15 -4,-2.23 84,-2.23 84,89.15
IMU_INT  (via drill 0.35)
  Top 0.254: U$3.INT 46.67,30.35 v43.05,30.35
  Bottom 0.254: v43.05,30.35 35.56,30.35 33.53,32.39 23.14,32.39 20.42,29.67 18.47,29.67 PCB1.P$13
IMU_RESET  (via drill 0.35)
  Top 0.254: v49.25,16.89 47.52,18.62 44.02,18.62 42.77,19.86 42.77,25.17 42.19,25.76 v41.35,25.76
  Bottom 0.254: v49.25,16.89 54.02,12.12 U$3.RST | v41.35,25.76 34.92,25.76 31.37,29.31 24.84,29.31 23.67,28.14 18.72,28.14 16.72,26.14 PCB1.P$11
INT  (via drill 0.35)
  Top 0.254: v40,54.23 40.02,54.21 U$1.INT
  Bottom 0.254: v40,54.23 38.37,55.86 PCB1.P$35
MISO  (via drill 0.35)
  Top 0.254: J4.4 50.67,64.77 50.67,61.21 48.94,59.49 48.94,54.15 45.19,50.4 U$1.SO 42.06,50.42 v36.96,50.42
  Bottom 0.254: PCB1.P$21 21.69,38.08 22.48,38.86 22.48,47.5 27.4,52.42 35.84,52.42 36.19,52.07 36.19,51.18 v36.96,50.42
MOSI  (via drill 0.35)
  Top 0.254: v33.4,51.69 42.06,51.69 U$1.SI 44.81,51.67 48.08,54.94 48.08,64.77 J4.3
  Bottom 0.254: v33.4,51.69 27.56,51.69 23.11,47.24 23.11,35.48 21.94,34.32 17.94,34.32 PCB1.P$19
N$1  (via drill 0.35)
  Top 0.305: v58.37,25.25 v58.37,20.9
  Bottom 0.305: U$2.S 58.55,19.6 58.36,19.79 v58.36,20.9 v58.37,20.9 | R3.1 v58.36,25.26 v58.37,25.25
N$2
  Bottom 0.305: R7.2 66.28,20.45 C6.1 R6.1
N$3
  Top 0.305: R10.1 41.29,39.94 C4.1 44.49,39.96 R1.2 45.18,39.98 47.01,41.81 47.8,41.81 D1.A 49.46,41.82 50.06,42.42 R2.1
N$4
  Bottom 0.254: Q4.3 D2.C
N$5
  Bottom 0.305: R5.1 45.49,16.69 D2.A
N$6  (via drill 0.35)
  other vias: 11.73,65
N$7  (via drill 0.35)
  other vias: 32.43,16.46
N$9
  Top 0.254: R18.1 32.83,67.59 D3.A
N$10
  Top 0.254: R17.2 49.71,35.49 Q5.2
N$11
  Top 0.254: D4.A R17.1
N$16  (via drill 0.35)
  other vias: 67.56,50.44
OSC1
  Top 0.254: R19.2 54.34,56.38 53.47,55.5 51.49,55.5 U$1.OSC1
OSC1_XTAL
  Top 0.254: R19.1 60.19,56.38 61.2,57.39 Y1.1 68.41,57.39 C2.2
OSC2
  Top 0.254: R11.2 54.57,53.25 53.59,54.23 51.49,54.23 U$1.OSC2
OSC2_XTAL
  Top 0.254: C1.2 68.45,52.51 Y1.2 61.15,52.51 60.32,53.34 60.2,53.34 57.69,53.34 R11.1
PI_POWER
  Top 1.016: U$5.IP1- U$5.IP2- 24.5,31.76 25.65,30.61 31.88,30.61 36.19,26.29 36.19,11.68 33.4,8.89 23.11,8.89 17.65,3.43 12.95,3.43 10.67,5.71 10.67,9.17 PCB1.P$2 PCB1.P$4
PWM  (via drill 0.35)
  Top 0.305: v37.57,54.89 38.76,54.89 v39.95,56.08
  Bottom 0.305: PCB1.P$33 18.29,54.89 v37.57,54.89 | v39.95,56.08 43.53,56.08 49.83,49.78 58.31,49.78 U$12.P$2
RESET  (via drill 0.35)
  Top 0.305: R1.1 v44.5,43.15 v44.5,43.16 | v44.5,46.41 44.5,47.27 43.92,47.85 U$1.RESET
  Bottom 0.305: v44.5,43.16 v44.5,46.41
RESET_TO_PI  (via drill 0.35)
  Top 0.254: R10.2 36.23,41.64 v35.58,41
  Bottom 0.254: v35.58,41 33.55,38.96 28.6,38.96 27.51,37.87 27.51,35.13 26.41,34.04 23.6,34.04 20.02,30.46 PCB1.P$15
RX  (via drill 0.35)
  Top 0.305: J8.3 8.79,40.87 arc90 9.19,40.46 10.17,40.46 arc-90 10.58,40.06 10.58,38.66 arc-90 10.17,38.25 9.19,38.25 arc90 8.79,37.85 8.79,36.58 v9.57,35.79
  Bottom 0.305: PCB1.P$10 13.24,22.84 11.53,24.54 11.53,33.83 v9.57,35.79
RXCAN  (via drill 0.35)
  Top 0.305: v56.62,37.57 56.62,38.52 arc-90 57.02,38.93 57.04,38.93 arc90 57.44,39.33 57.44,39.82 arc90 57.04,40.23 56.19,40.23 arc-90 55.79,40.63 55.79,41.12 arc-90 56.19,41.53 57.04,41.53 arc90 57.44,41.93 57.44,42.42 arc90 57.04,42.82 57.02,42.82 arc-90 56.62,43.23 56.62,44.58 53.33,47.86 U$1.RXCAN
  Bottom 0.305: U$2.RXD 54.51,24.84 55.27,25.6 55.27,34.9 56.62,36.25 v56.62,37.57
SCL  (via drill 0.35)
  Top 0.254: 50.09,6.28 50.04,6.22
  Top 0.406: v50.04,5.59 50.04,6.22 50.04,8.86 U$3.SCL 54.39,13.21 71.91,13.21 J1.2 | R9.2 50.09,6.28 | Q1.2 21.32,25.2 20.86,24.75 R15.1 20.86,20.36 v20.85,20.34
  Bottom 0.254: 20.17,9.38 20.17,9.42
  Bottom 0.406: v50.04,5.59 50.04,3.68 49.53,3.17 28.42,3.17 J3.2 24.61,6.98 22.56,6.98 20.17,9.38 | 20.17,9.42 18.79,10.79 13.49,10.79 12.19,12.1 11.83,12.46 | v20.85,20.34 20.85,17.3 20.32,16.76 17.71,16.76 PCB1.P$5 15.42,19.05 9.6,19.05 | 9.6,19.05 9.6,18.21 9.6,14.69 11.41,12.88 11.83,12.46 | U$4.P$2 9.02,28.76 9.6,28.18 9.6,19.05 | U$7.P$2 9.09,9.73 11.83,12.46 | U$6.P$2 7.04,19.44 7.43,19.05 9.6,19.05
SCL_ADC
  Top 0.406: U1.5 22.46,23.09 23.37,24 26.01,24 arc90 26.4,24.4 26.4,24.56 arc-90 26.8,24.96 26.99,24.96 arc-90 27.38,24.56 27.38,24.4 arc90 27.78,24 27.97,24 arc90 28.36,24.4 28.36,24.56 arc-90 28.76,24.96 28.95,24.96 arc-90 29.34,24.56 29.34,24.4 arc90 29.74,24 30.35,24 31.01,24.66 31.01,25.58 30.44,26.15 29.54,26.15 | Q1.3 29.54,26.15 | 29.54,26.15 R14.2
SDA  (via drill 0.35)
  Top 0.254: 28.84,10.67 Q3.2 | 32.24,10.81 v32.26,10.79 | R8.2 48.13,6.26
  Top 0.406: 28.84,10.67 26.8,10.67 26.5,10.97 R12.1 21.04,10.97 20.06,11.94 PCB1.P$3 15.42,16.51 8.46,16.51 8.43,16.48 | Q3.2 32.24,10.81 | 48.13,8 48.64,8 48.94,8.3 U$3.SDA 48.94,13.33 52.53,16.92 69.37,16.92 J1.3 | 48.13,8 v46.48,8 | 48.13,6.26 48.13,8 | 8.43,18.16 8.43,19.43 8.43,26.56 7.48,27.51 U$4.P$3 | 8.43,18.16 8.43,16.48 | U$6.P$3 8.4,18.19 8.43,18.16 | U$7.P$3 7.97,8.48 8.43,8.94 8.43,16.48
  Bottom 0.406: v32.26,10.79 33.65,12.19 33.65,17.53 34.54,18.41 37.34,18.41 38.35,17.4 38.35,8.89 39.24,8 | v46.48,8 39.24,8 | 39.24,8 36.54,5.3 35.6,5.3 arc-90 35.2,5.7 35.2,5.76 arc90 34.81,6.15 34.14,6.15 arc90 33.74,5.76 33.74,5.7 arc-90 33.35,5.3 32.68,5.3 arc-90 32.28,5.7 32.28,5.76 arc90 31.89,6.15 31.22,6.15 arc90 30.82,5.76 30.82,5.7 arc-90 30.43,5.3 J3.3
SDA_ADC  (via drill 0.35)
  Top 0.406: U1.6 23.74,21.6 v26.29,19.05 | Q3.3 31.95,11.76 32.59,12.39 32.59,14.55 31.75,15.39 R13.2 | R13.2 | v28.17,15.39 R13.2
  Bottom 0.406: v26.29,19.05 26.8,18.54 26.8,16.13 27.53,15.39 v28.17,15.39
TX  (via drill 0.35)
  Top 0.305: J8.2 7.39,41.43 7.39,36.02 v8.51,34.9
  Bottom 0.305: v8.51,34.9 10.56,32.84 10.56,23.91 PCB1.P$8
TXCAN  (via drill 0.35)
  Top 0.254: v52.02,20.52 v52.02,23.14 | v53.14,45.52 53.14,46.41 52.96,46.58 U$1.TXCAN
  Top 0.305: U$1.TXCAN
  Bottom 0.254: U$2.TXD 52.94,19.6 v52.02,20.52 | v52.02,23.14 52.02,24.82 54.51,27.3 54.51,34.95 53.14,36.32 v53.14,45.52

### Text on the board
tPlace: GND | 5V | 5V | CANH | GND | CLK | MOSI | MISO | CS | ROV X11 | CANL | Pi Shield v1.0 | Conner Swift | Jacob Bobson | DI3 | Jason King | CANL | DI2 | DI1 | GND | GND | PWM | CANH | 5V | GND | TX | RX | GND | DI | 3.3V | 5V | AIN | GND | AIN | 3.3V | GND | 5V | CANL | 3.3V | SCL | SDA | CANH | GND | 3.3V | GND | 3.3V | SCL | SDA | GND | 3.3V | SDA | SCL | GND | 3.3V | GND | SCL | SDA | GND | GND | SCL | SDA | 3.3V | GND